# Altium project POWER_SUPPLY_60V_60A.PrjPcb
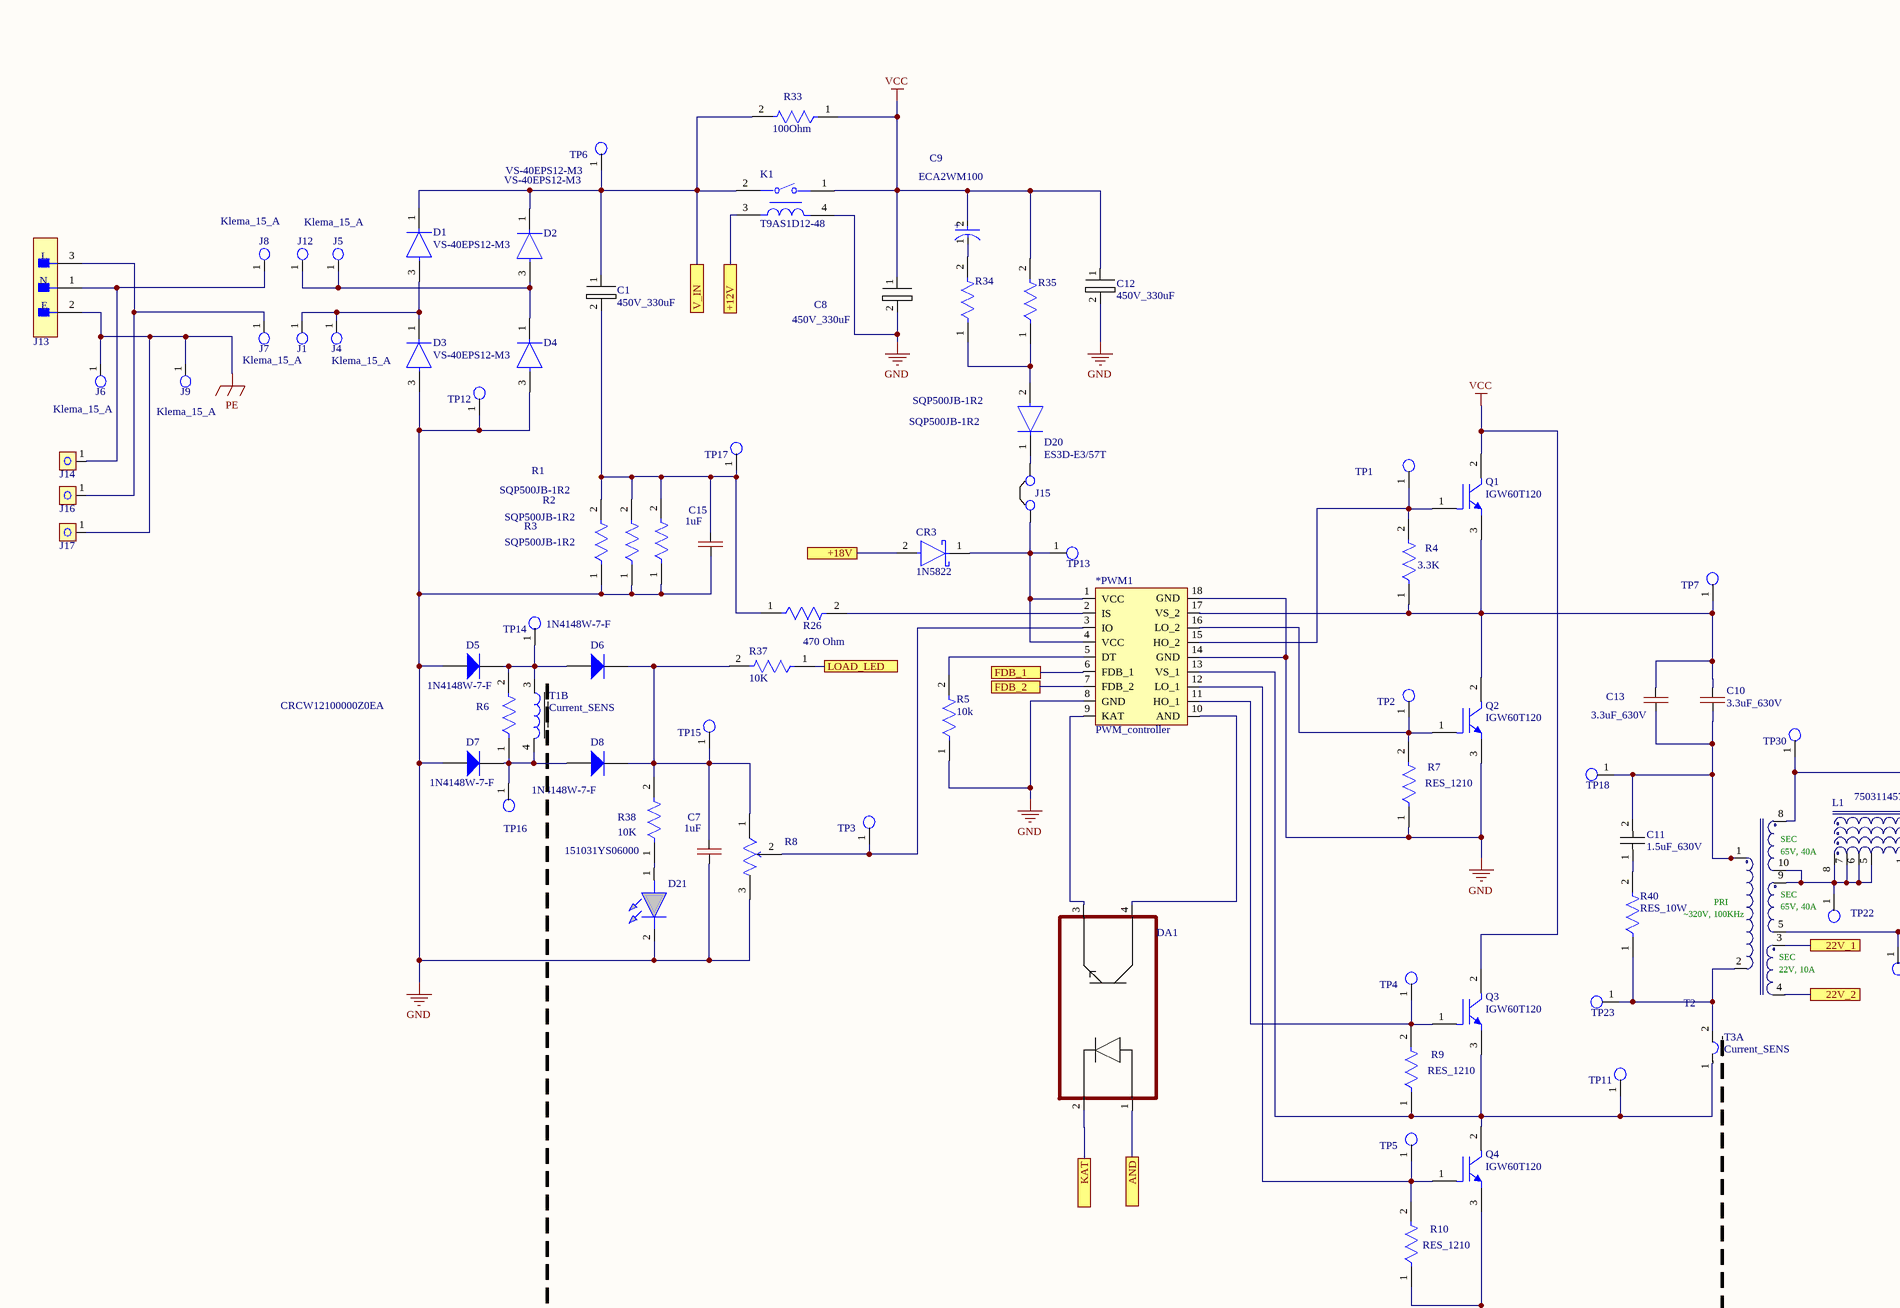
[diagram p0: POWER_SUPPLY_60V_60A.SchDoc, top left]
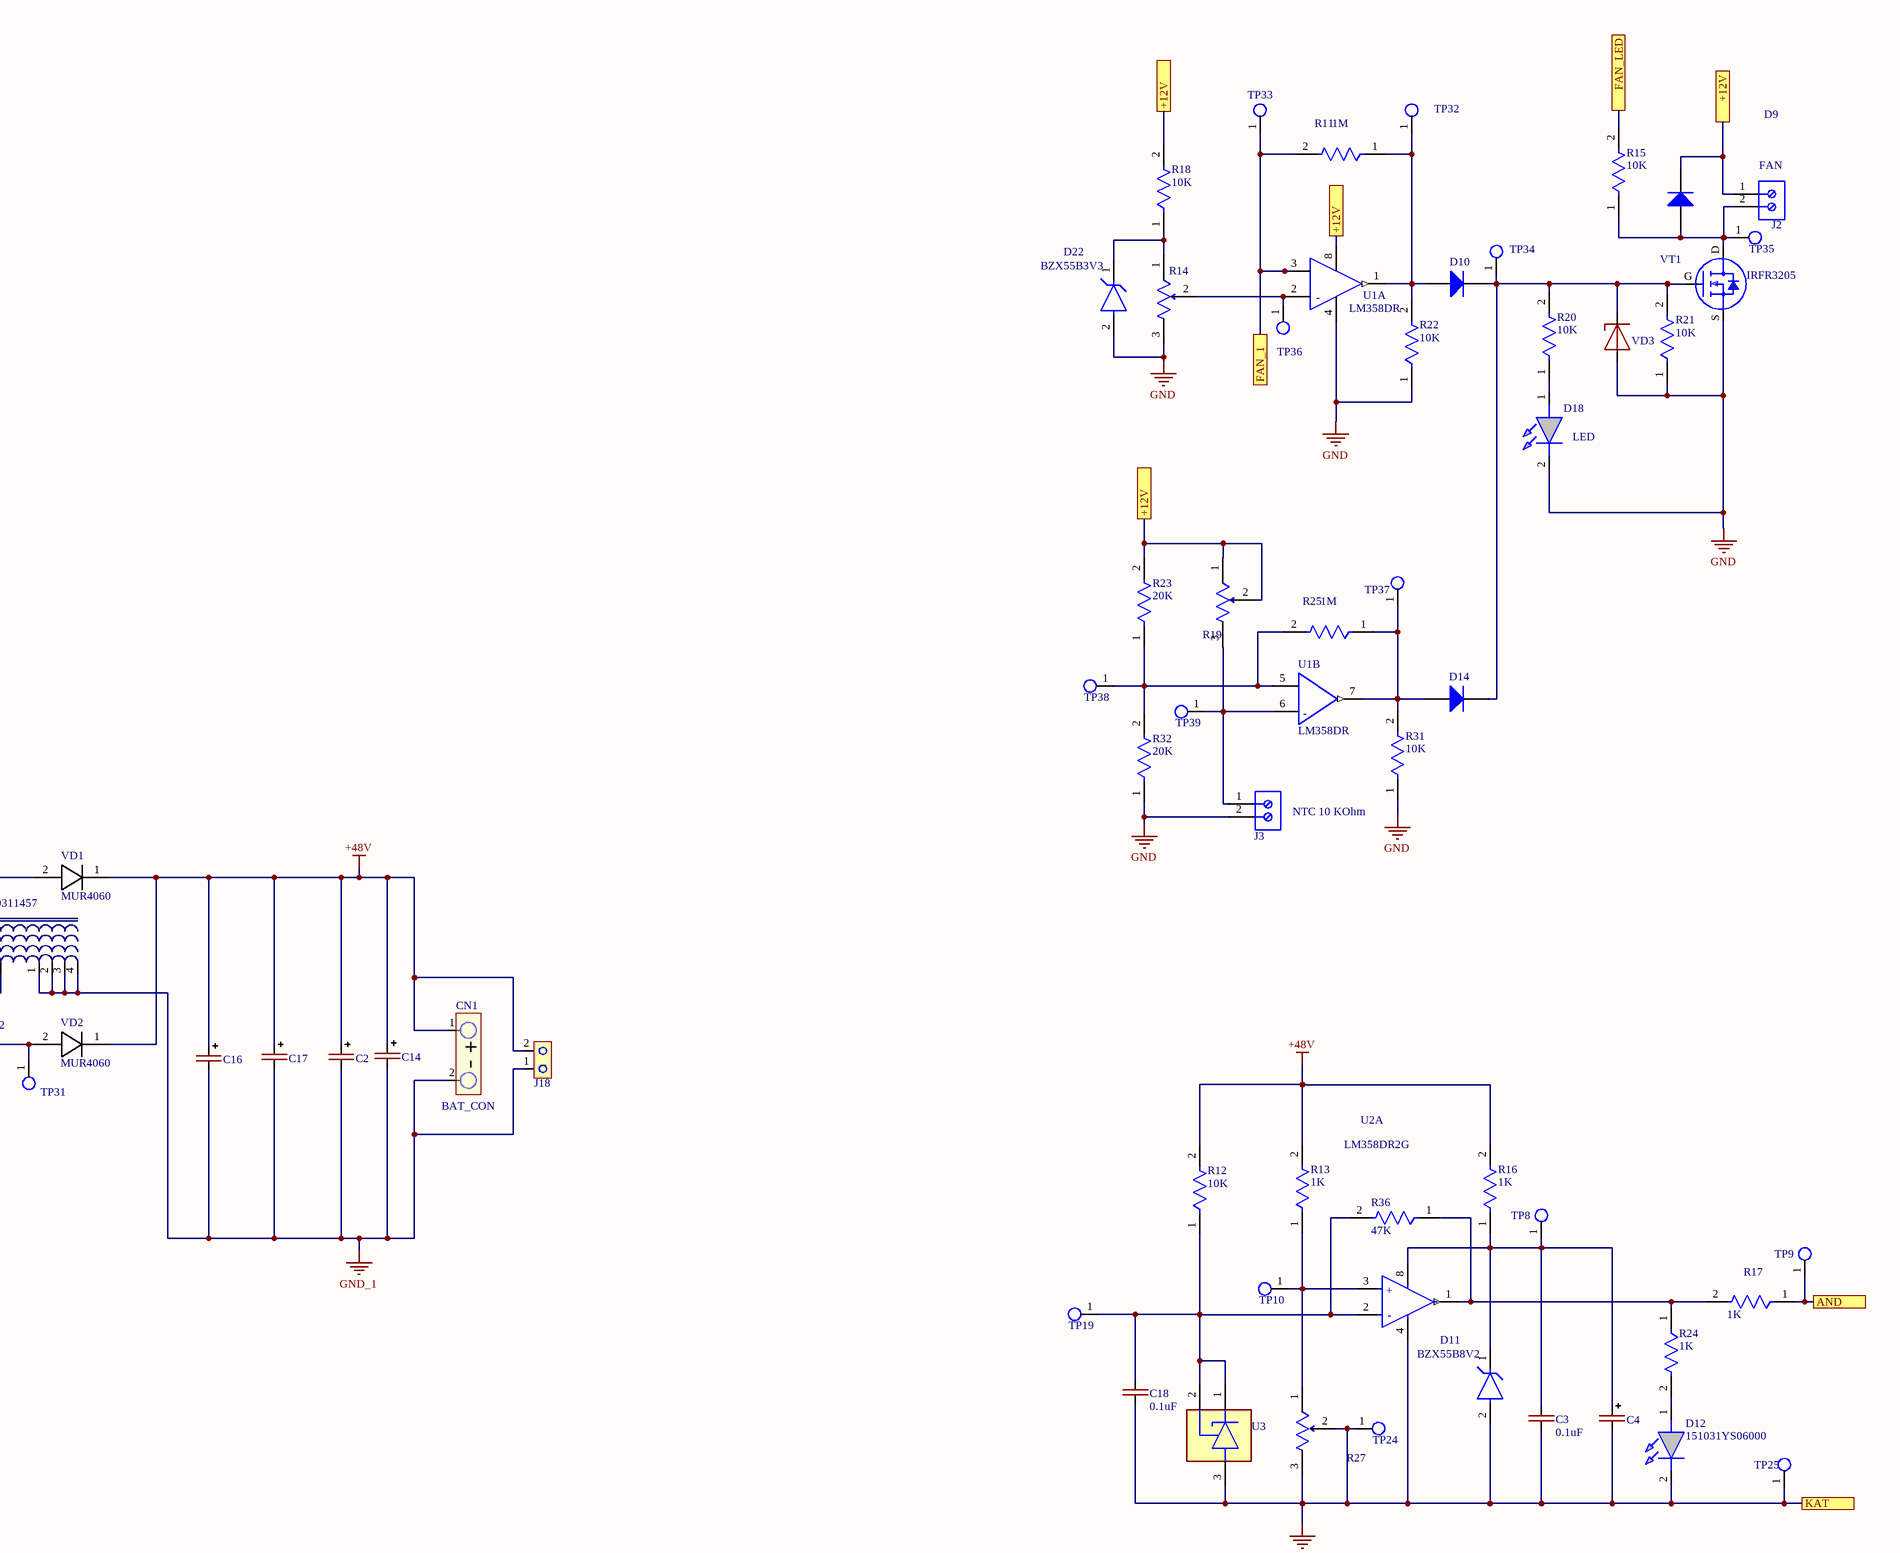
[diagram p1: POWER_SUPPLY_60V_60A.SchDoc, top right]
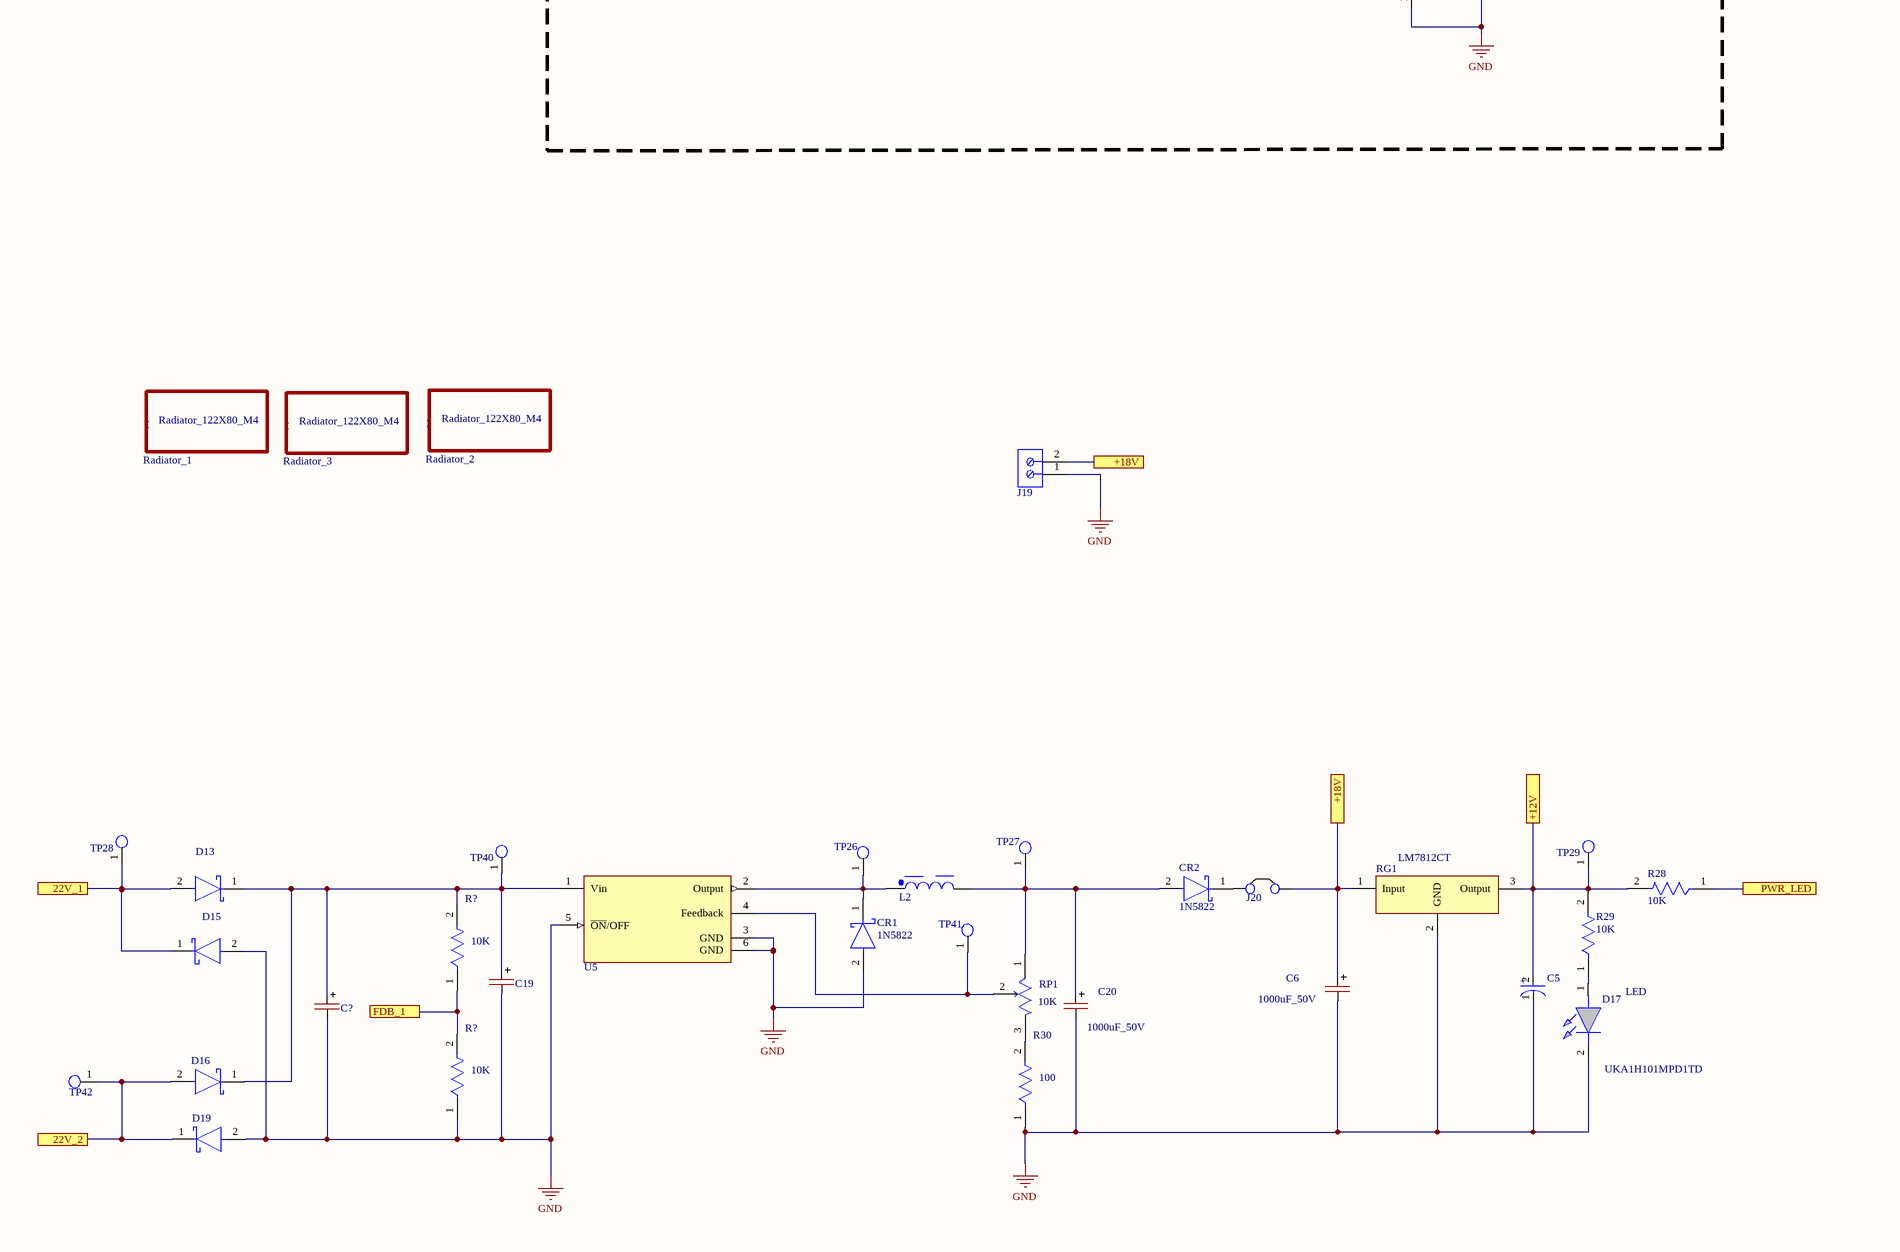
[diagram p2: POWER_SUPPLY_60V_60A.SchDoc, bottom left]
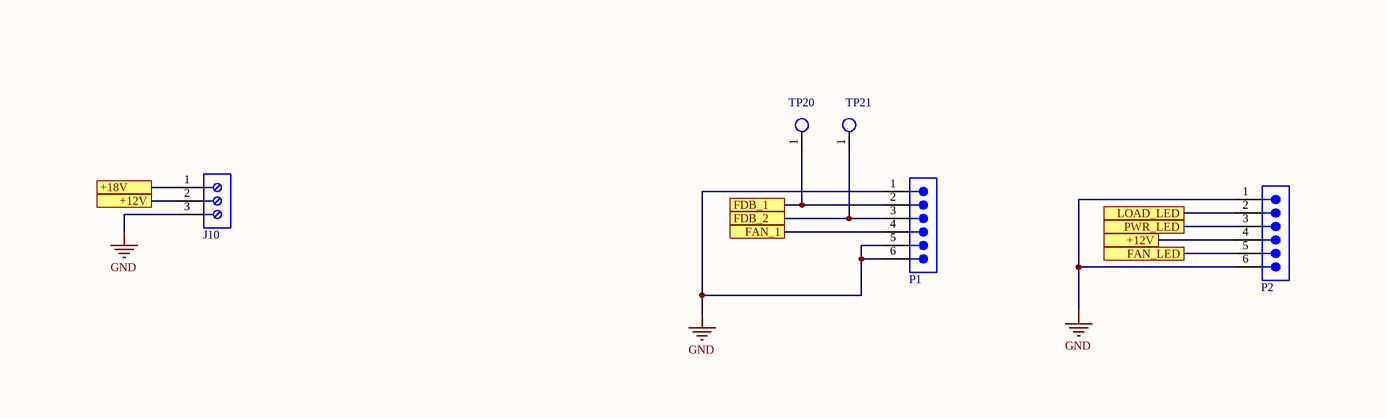
[diagram p3: POWER_SUPPLY_60V_60A.SchDoc, bottom right]
1 sheet, 176 parts. Net scope: flat (ports and power ports of the same name join across sheets).
Board file: POWER_SUPPLY_60V_60A.PcbDoc

## Sheet POWER_SUPPLY_60V_60A.SchDoc
size A1; SheetNumber: 1; SheetTotal: 1

### Parts
(Parts that share a designator on the sheet are numbered #1, #2 ... from top to bottom, then left to right.)
*PWM1  PWM_controller  [PWM_controller]
C1  450V_330uF  [CAP_450V_330uF]
C2  CAP-POLAR  [CAPPOL-18x40]  (value not drawn)
C3  0.1uF  [CAP-0805]
C4  CAP-POLAR  [CAP-TAN-D]  (value not drawn)
C5  UKA1H101MPD1TD  [FP-UKA1H101MPD1TD-MFG]
C6  1000uF_50V  [CAP_POL_13x26_1000uF_50V]
C7  1uF  [CAP-0805]
C8  450V_330uF  [CAP_450V_470uF]
C9  ECA2WM100  [FP-RAD-TH-D_12_5_0_5-L_20-MFG]
C10  3.3uF_630V  [CAP_4.7uF_630V]
C11  1.5uF_630V  [CAP_1.5uf_400V]
C12  450V_330uF  [CAP_450V_470uF]
C13  3.3uF_630V  [CAP_4.7uF_630V]
C14  CAP-POLAR  [CAPPOL-18x40]  (value not drawn)
C15  1uF  [CAP-0805]
C16  CAP-POLAR  [CAPPOL-30x35]  (value not drawn)
C17  CAP-POLAR  [CAPPOL-18x40]  (value not drawn)
C18  0.1uF  [CAP-0805]
C19  CAP-POLAR  [CAPPOL-18x40]  (value not drawn)
C20  1000uF_50V  [CAP_POL_13x26_1000uF_50V]
C?  CAP-POLAR  [CAPPOL-18x40]  (value not drawn)
CN1  BAT_CON  [Batarey_connector]
CR1  1N5822  [FP-DO-201AD-MFG]
CR2  1N5822  [FP-DO-201AD-MFG]
CR3  1N5822  [FP-DO-201AD-MFG]
D1  VS-40EPS12-M3  [FP-96144-MFG]
D2  VS-40EPS12-M3  [FP-96144-MFG]
D3  VS-40EPS12-M3  [FP-96144-MFG]
D4  VS-40EPS12-M3  [FP-96144-MFG]
D5  1N4148W-7-F  [DIOD-SOD123-2_V]
D6  1N4148W-7-F  [DIOD-SOD123-2_V]
D7  1N4148W-7-F  [DIOD-SOD123-2_V]
D8  1N4148W-7-F  [DIOD-SOD123-2_V]
D9  (no value)  [DIOD-SOD123-2_V]
D10  (no value)  [DIOD-SOD123-2_V]
D11  BZX55B8V2  [BZX55B8V2]
D12  151031YS06000  [LED_BLUE]
D13  (no value)  [SR5100(DO-201AD]
D14  (no value)  [DIOD-SOD123-2_V]
D15  (no value)  [SR5100(DO-201AD]
D16  (no value)  [SR5100(DO-201AD]
D17  LED  [LED_GREEN]
D18  LED  [LED_BLUE]
D19  (no value)  [SR5100(DO-201AD]
D20  ES3D-E3/57T  [DO214-AB]
D21  151031YS06000  [LED_GREEN]
D22  BZX55B3V3  [BZX55B8V2]
DA1  PC817  [4-SMD]  (value not drawn)
J1  (no value)  [Klema_PCB_15A]
J2  691137710002  [691137710002]  (value not drawn)
J3  691137710002  [691137710002]  (value not drawn)
J4  Klema_15_A  [Klema_PCB_15A]
J5  Klema_15_A  [Klema_PCB_15A]
J6  Klema_15_A  [Klema_PCB_15A]
J7  Klema_15_A  [Klema_PCB_15A]
J8  Klema_15_A  [Klema_PCB_15A]
J9  Klema_15_A  [Klema_PCB_15A]
J10  691101710003  [691101710003]  (value not drawn)
J12  (no value)  [Klema_PCB_15A]
J13  L-PE-N  [L-PE-N_Connector_C-14]  (value not drawn)
J14  MG_136_HT  [Conn_MEIGAN_MG136HT]  (value not drawn)
J15  (no value)  [Jumper_2.54]
J16  MG_136_HT  [Conn_MEIGAN_MG136HT]  (value not drawn)
J17  MG_136_HT  [Conn_MEIGAN_MG136HT]  (value not drawn)
J18  TL-800  [Conn_Tianli_T-800]  (value not drawn)
J19  691101710002  [691101710002]  (value not drawn)
J20  (no value)  [Jumper_2.54]
K1  T9AS1D12-48  [NT90RNCS12CB]
L1  750311457  [Drossel]
L2  22µH, 2.04A  [WE-PD2_1054]  (value not drawn)
P1  61900611121  [61900611121]  (value not drawn)
P2  61900611121  [61900611121]  (value not drawn)
Q1  IGW60T120  [TO-264-3]
Q2  IGW60T120  [TO-264-3]
Q3  IGW60T120  [TO-264-3]
Q4  IGW60T120  [TO-264-3]
R1  SQP500JB-1R2  [FP-SQP500-MFG]
R2  SQP500JB-1R2  [FP-SQP500-MFG]
R3  SQP500JB-1R2  [FP-SQP500-MFG]
R4  3.3K  [RES_SMD_1210_IPC_A]
R5  10k  [RES-0805]
R6  CRCW12100000Z0EA  [FP-CRCW1210-e3-IPC_A]
R7  RES_1210  [RES_SMD_1210_IPC_A]
R8  3296W-1-202LF  [Bourns_3296W_MFG]  (value not drawn)
R9  RES_1210  [RES_SMD_1210_IPC_A]
R10  RES_1210  [RES_SMD_1210_IPC_A]
R11  1M  [RES-0805]
R12  10K  [RES-0805]
R13  1K  [RES-0805]
R14  10K  [RES_Adj_3296W_Bourns]  (value not drawn)
R15  10K  [RES-0805]
R16  1K  [RES-0805]
R17  1K  [RES-0805]
R18  10K  [RES-0805]
R19  10K  [RES_Adj_3296W_Bourns]  (value not drawn)
R20  10K  [RES-0805]
R21  10K  [RES-0805]
R22  10K  [RES-0805]
R23  20K  [RES-0805]
R24  1K  [RES-0805]
R25  1M  [RES-0805]
R26  470 Ohm  [RES-0805]
R27  10K  [RES_Adj_3296W_Bourns]  (value not drawn)
R28  10K  [FP-CRCW0805-e3-MFG]
R29  10K  [FP-CRCW0805-e3-MFG]
R30  100  [RES-0805]
R31  10K  [RES-0805]
R32  20K  [RES-0805]
R33  100Ohm  [10W 3 Ohm]
R34  SQP500JB-1R2  [FP-SQP500-MFG]
R35  SQP500JB-1R2  [FP-SQP500-MFG]
R36  47K  [RES-0805]
R37  10K  [FP-CRCW0805-e3-MFG]
R38  10K  [RES-0805]
R40  RES_10W  [10W 3 Ohm]
R?#1  10K  [RES-0805]
R?#2  10K  [RES-0805]
Radiator_1  Radiator_122X80_M4  [Radiator_122X80_M4]  (value not drawn)
Radiator_2  Radiator_122X80_M4  [Radiator_122X80_M4]  (value not drawn)
Radiator_3  Radiator_122X80_M4  [Radiator_122X80_M4]  (value not drawn)
RG1  LM7812CT  [TO-220_Bended_Rad]
RP1  10K  [RES_Adj_3296W_Bourns]
T1  Current_SENS  [Current_Sens_Case]  (part B of 2)
T2  ETD-59_2  [Transformer_ETD59_2]  (value not drawn)
T3  Current_SENS  [Current_Sens_Case]  (part A of 2)
TP1  Test_Point_PCB  [Test_Point]  (value not drawn)
TP2  Test_Point_PCB  [Test_Point]  (value not drawn)
TP3  Test_Point_PCB  [Test_Point]  (value not drawn)
TP4  Test_Point_PCB  [Test_Point]  (value not drawn)
TP5  Test_Point_PCB  [Test_Point]  (value not drawn)
TP6  Test_Point_PCB  [Test_Point]  (value not drawn)
TP7  Test_Point_PCB  [Test_Point]  (value not drawn)
TP8  Test_Point_PCB  [Test_Point]  (value not drawn)
TP9  Test_Point_PCB  [Test_Point]  (value not drawn)
TP10  Test_Point_PCB  [Test_Point]  (value not drawn)
TP11  Test_Point_PCB  [Test_Point]  (value not drawn)
TP12  Test_Point_PCB  [Test_Point]  (value not drawn)
TP13  Test_Point_PCB  [Test_Point]  (value not drawn)
TP14  Test_Point_PCB  [Test_Point]  (value not drawn)
TP15  Test_Point_PCB  [Test_Point]  (value not drawn)
TP16  Test_Point_PCB  [Test_Point]  (value not drawn)
TP17  Test_Point_PCB  [Test_Point]  (value not drawn)
TP18  Test_Point_PCB  [Test_Point]  (value not drawn)
TP19  Test_Point_PCB  [Test_Point]  (value not drawn)
TP20  Test_Point_PCB  [Test_Point]  (value not drawn)
TP21  Test_Point_PCB  [Test_Point]  (value not drawn)
TP22  Test_Point_PCB  [Test_Point]  (value not drawn)
TP23  Test_Point_PCB  [Test_Point]  (value not drawn)
TP24  Test_Point_PCB  [Test_Point]  (value not drawn)
TP25  Test_Point_PCB  [Test_Point]  (value not drawn)
TP26  Test_Point_PCB  [Test_Point]  (value not drawn)
TP27  Test_Point_PCB  [Test_Point]  (value not drawn)
TP28  Test_Point_PCB  [Test_Point]  (value not drawn)
TP29  Test_Point_PCB  [Test_Point]  (value not drawn)
TP30  Test_Point_PCB  [Test_Point]  (value not drawn)
TP31  Test_Point_PCB  [Test_Point]  (value not drawn)
TP32  Test_Point_PCB  [Test_Point]  (value not drawn)
TP33  Test_Point_PCB  [Test_Point]  (value not drawn)
TP34  Test_Point_PCB  [Test_Point]  (value not drawn)
TP35  Test_Point_PCB  [Test_Point]  (value not drawn)
TP36  Test_Point_PCB  [Test_Point]  (value not drawn)
TP37  Test_Point_PCB  [Test_Point]  (value not drawn)
TP38  Test_Point_PCB  [Test_Point]  (value not drawn)
TP39  Test_Point_PCB  [Test_Point]  (value not drawn)
TP40  Test_Point_PCB  [Test_Point]  (value not drawn)
TP41  Test_Point_PCB  [Test_Point]  (value not drawn)
TP42  Test_Point_PCB  [Test_Point]  (value not drawn)
U1  LM358DR  [FP-D0008A-MFG]  (parts A,B of 2)
U2  LM358DR2G  [FP-751-07-IPC_C]  (part A of 2)
U3  (no value)  [TL431_SOT-23-3(A)]
U5  (no value)  [ON_Semiconductor_936A-02_MFG]
VD1  MUR4060  [TO-247-2]
VD2  MUR4060  [TO-247-2]
VD3  ZENER  [DO-017AA]  (value not drawn)
VT1  IRFR3205  [TO-220(bend2)]

### Ports
22V_1, 22V_2, +12V, +18V, AND, FAN_1, FAN_LED, FDB_1, FDB_2, KAT, LOAD_LED, PWR_LED, V_IN

### Nets
+48V: C2.1(+) C14.1(+) C16.1(+) C17.1(+) CN1.1(+) J18.2 R12.2 R13.2 R16.2 VD1.1 VD2.1
GND: *PWM1.8(GND) *PWM1.14(GND) *PWM1.18(GND) C5.1(C) C6.2(-) C7.2 C8.2 C12.2 C15.2 C19.2(-) C20.2(-) C?.2(-) CR1.2(A) D3.3(A) D4.3(A) D5.1(K) D7.1(K) D15.2(A) D17.2(K) D18.2(K) D19.2(A) D21.2(K) D22.2(A) J3.2 J10.3 J19.1 K1.4 P1.1 P1.5 P1.6 P2.1 P2.6 Q2.3(E) Q4.3(E) R1.1 R2.1 R3.1 R5.1 R7.1 R8.3(CW) R10.1 R14.3(CW) R21.1 R22.1 R30.1 R31.1 R32.1 R?#2.1 RG1.2(GND) TP12.1(G9) U1.4(V-) U5.3(GND) U5.5(~{ON}/OFF) U5.6(GND) VD3.2(A) VT1.S
GND_1: C2.2(-) C3.1 C4.2(-) C14.2(-) C16.2(-) C17.2(-) C18.1 CN1.2(-) D11.2(A) D12.2(K) DA1.2(CATHODE) J18.1 L1.1 L1.2 L1.3 L1.4 R27.2(WIPER) R27.3(CW) TP24.1(G9) TP25.1(G9) U2.4(VEE/GND) U3.3(A) ; port KAT
PE: J6.1 J9.1 J13.2(E) J17.1
VCC: C8.1 C9.2(A) C12.1 K1.1 Q1.2(C) Q3.2(C) R33.1 R35.2
Net*PWM1_1: *PWM1.1(VCC) *PWM1.4(VCC) CR3.1(C) J15.1 TP13.1(G9)
Net*PWM1_2: *PWM1.2(IS) R26.2
Net*PWM1_3: *PWM1.3(IO) R8.2(WIPER) TP3.1(G9)
Net*PWM1_5: *PWM1.5(DT) R5.2
Net*PWM1_6: *PWM1.6(FDB_1) P1.2 R?#1.1 R?#2.2 TP20.1(G9) ; port FDB_1
Net*PWM1_7: *PWM1.7(FDB_2) P1.3 TP21.1(G9) ; port FDB_2
Net*PWM1_9: *PWM1.9(KAT) DA1.3(EMITTER)
Net*PWM1_10: *PWM1.10(AND) DA1.4(COLLECTOR)
Net*PWM1_11: *PWM1.11(HO_1) Q3.1(G) R9.2 TP4.1(G9)
Net*PWM1_12: *PWM1.12(LO_1) Q4.1(G) R10.2 TP5.1(G9)
Net*PWM1_13: *PWM1.13(VS_1) Q3.3(E) Q4.2(C) R9.1 T3.1 TP11.1(G9)
Net*PWM1_15: *PWM1.15(HO_2) Q1.1(G) R4.2 TP1.1(G9)
Net*PWM1_16: *PWM1.16(LO_2) Q2.1(G) R7.2 TP2.1(G9)
Net*PWM1_17: *PWM1.17(VS_2) C10.2 C13.2 Q1.3(E) Q2.2(C) R4.1 TP7.1(G9)
NetC1_1: C1.1 D1.1(C) D2.1(C) K1.2 R33.2 TP6.1(G9) ; port V_IN
NetC1_2: C1.2 C15.1 R1.2 R2.2 R3.2 R26.1 TP17.1(G9)
NetC3_2: C3.2 C4.1(+) D11.1(C) R16.1 TP8.1(G9) U2.8(VCC)
NetC5_2: C5.2(A) D9.1(K) J2.1 J10.2 K1.3 P2.4 R18.2 R19.1(CCW) R19.2(WIPER) R23.2 R28.2 R29.2 RG1.3(Output) TP29.1(G9) U1.8(V+) ; port +12V
NetC6_1: C6.1(+) CR3.2(A) J10.1 J19.2 J20.2 RG1.1(Input) ; port +18V
NetC7_1: C7.1 D6.2(A) D8.2(A) R8.1(CCW) R37.2 R38.2 TP15.1(G9)
NetC9_1: C9.1(C) R34.2
NetC10_1: C10.1 C11.2 C13.1 T2.1 TP18.1(G9)
NetC11_1: C11.1 R40.2
NetC18_2: C18.2 R12.1 R36.2 TP19.1(G9) U2.2(INPUT_A-) U3.1(C) U3.2(REF)
NetC19_1: C19.1(+) C?.1(+) D13.1(C) D16.1(C) R?#1.2 TP40.1(G9) U5.1(Vin)
NetC20_1: C20.1(+) CR2.2(A) L2.2 RP1.1(CCW) TP27.1(G9)
NetCR1_1: CR1.1(C) L2.1 TP26.1(G9) U5.2(Output)
NetCR2_1: CR2.1(C) J20.1
NetD1_3: D1.3(A) D3.1(C) J1.1 J4.1
NetD2_3: D2.3(A) D4.1(C) J5.1 J12.1
NetD5_2: D5.2(A) D6.1(K) R6.2 T1.3 TP14.1(G9)
NetD7_2: D7.2(A) D8.1(K) R6.1 T1.4 TP16.1(G9)
NetD9_2: D9.2(A) J2.2 R15.1 TP35.1(G9) VT1.D
NetD10_1: D10.1(K) D14.1(K) R20.2 R21.2 TP34.1(G9) VD3.1(C) VT1.G
NetD10_2: D10.2(A) R11.1 R22.2 TP32.1(G9) U1.1(1OUT)
NetD12_1: D12.1(A) R24.2
NetD13_2: D13.2(A) D15.1(C) T2.3 TP28.1(G9) ; port 22V_1
NetD14_2: D14.2(A) R25.1 R31.2 TP37.1(G9) U1.7(2OUT)
NetD16_2: D16.2(A) D19.1(C) T2.4 TP42.1(G9) ; port 22V_2
NetD17_1: D17.1(A) R29.1
NetD18_1: D18.1(A) R20.1
NetD20_1: D20.1(C) J15.2
NetD20_2: D20.2(A) R34.1 R35.1
NetD21_1: D21.1(A) R38.1
NetD22_1: D22.1(C) R14.1(CCW) R18.1
NetDA1_1: DA1.1(ANODE) R17.1 TP9.1(G9) ; port AND
NetJ3_1: J3.1 R19.3(CW) TP39.1(G9) U1.6(IN2-)
NetJ7_1: J7.1 J13.3(L) J16.1
NetJ8_1: J8.1 J13.1(N) J14.1
NetL1_5: L1.5 L1.6 L1.7 L1.8 T2.9 T2.10 TP22.1(G9)
NetP1_4: P1.4 R11.2 TP33.1(G9) U1.3(IN1+) ; port FAN_1
NetP2_2: P2.2 R37.1 ; port LOAD_LED
NetP2_3: P2.3 R28.1 ; port PWR_LED
NetP2_5: P2.5 R15.2 ; port FAN_LED
NetR13_1: R13.1 R27.1(CCW) TP10.1(G9) U2.3(INPUT_A+)
NetR14_2: R14.2(WIPER) TP36.1(G9) U1.2(IN1-)
NetR17_2: R17.2 R24.1 R36.1 U2.1(OUTPUT_A)
NetR23_1: R23.1 R25.2 R32.2 TP38.1(G9) U1.5(IN2+)
NetR30_2: R30.2 RP1.3(CW)
NetR40_1: R40.1 T2.2 T3.2 TP23.1(G9)
NetRP1_2: RP1.2(WIPER) TP41.1(G9) U5.4(Feedback)
NetT2_5: T2.5 TP31.1(G9) VD2.2
NetT2_8: T2.8 TP30.1(G9) VD1.2

### Notes on the sheet
- (near J2) FAN
- NTC 10 KOhm
- (in symbol CMP-1310-00291-2, part A) +; -
- (in symbol CMP-1685-00009-2, part A) -
- (in symbol CMP-1685-00009-2, part B) -
- (in symbol CMP-05427-001155-1) +
- (in symbol CMP-12462-000027-1) +
- (in symbol Transformer_ETD_59_2) SEC; 65V, 40A; PRI; ~320V, 100KHz; 22V, 10A

### Library data of the parts
C1 C8 C12 = CAP_POL_LOW_IMP
C3 C7 C10 C13 C15 C18 = CAP-NON-POLAR
C5 = CMP-12462-000027-1: CAP ALUM 100UF 20% 50V RADIAL; Life (Hours): 2000Hour; Ripple Current: 190mA; Leakage Current: 4uA; Termination: Radial; Mount: Through Hole; Length: 11.5mm; Series: KA; Case/Package: Radial; Package Quantity: 1; REACH SVHC: No SVHC; Height - Seated (Max): 0.512inch; Min Operating Temperature: -55°C; Packaging: Tape and Reel; Tolerance: 20%; Lead Pitch: 3.5mm; Voltage Rating (DC): 50V; Voltage Rating: 50V; Diameter: 8mm; Height: 11.5mm; Max Operating Temperature: 105°C; Capacitance: 100uF
C6 C20 = CAP_polar_Hitano
C9 = CMP-05427-001155-1: Aluminum Electrolytic Capacitors (Radial Lead Type) 10uF ±20% 450V; Ripple Current (AC): 130mA; Lead/Base Style: Straight; Leakage Current: 10uA; Lead Diameter: 0.6mm; Polarity: Polar; Life (Hours): 2000Hour; Dissipation Factor: 0.2%; Dielectric Material: Aluminium; Max Operating Temperature: 85°C; Capacitance: 10uF; Tolerance: 20%; Min Operating Temperature: -25°C; Height - Seated (Max): 0.866inch; Case/Package: Radial; Voltage Rating: 450V; Length: 20mm; Voltage: 450V; Diameter: 12.5mm; Number of Pins: 2; Lead Free: Lead Free; Packaging: Bulk; Mount: Through Hole; Series: M; RoHS Compliant: Yes; Ripple Current: 130mA; REACH SVHC: No SVHC; Voltage Rating (DC): 450V; Radiation Hardening: No; Termination: Radial; Lead Pitch: 5mm; Package Quantity: 200; Height: 20mm; Construction: RADIAL
C11 = 3.3uF_630V
CN1 = BAT_CON: Batarey_connection
CR1-CR3 = 1N5822: DIODE SCHOTTKY 40V 3A DO201AD; Manufacturer: STMicroelectronics; Max Junction Temp: +150°C; Peak Reverse Current: 2mA; Max Surge Forward Current: 80A; Temperature Range High: +150°C; Automotive: No; RoHS: TRUE; ComponentLink2Description: Datasheet; Manufacturer Part Number: 1N5822; Lead Free: Yes; Octopart: https://octopart.com/1n5822-stmicroelectronics-323225; Device Class L2: Diodes; Max Repetitive Reverse Voltage: 40V; Temperature: to +150°C; Height: 5.3mm; Category: Diode; Digikey Description: DIODE SCHOTTKY 40V 3A DO201AD; ComponentLink2URL: https://www.st.com/resource/en/datasheet/1n5822.pdf; Device Class L3: Schottky Diodes; Device Class L1: Discrete Semiconductors; Forward Current: 3A; Mouser Description: Schottky Diodes & Rectifiers Vr/40V Io/3A BULK; Package: DO-201AD
D1-D4 = CMP-02540-000097-1: DIODE GP 1.2KV 40A TO247AC; Series: -; Case/Package: TO-247-2; Mount: Through Hole; Max Reverse Voltage (DC): 1.2kV; RoHS Compliant: Yes; Packaging: Rail/Tube; Average Rectified Current: 40A
D5-D10 D14 = 1N4148: Fast Switching Diode, 100 V, 0.15 A, -65 to 150 degC, 2-Pin?SOD123, RoHS, Tape and Reel; Recovery Time: 4ns; Brand: DiodesIncorporated; Unit Weight: 0.000353oz; Max Surge Current: 2A; Peak Reverse Voltage: 100V; Ir - Reverse Current: 1uA; Vf - Forward Voltage: 1.25V; Configuration: Single; If - Forward Current: 0.15A; Product Category: Diodes-GeneralPurpose,Power,Switching; Operating Temperature Range: -65Cto+150C; Packaging: Reel; Manufacturer URL: http://www.diodes.com/; Maximum Operating Temperature: +150C; Height: 1.25mm; Minimum Operating Temperature: -65C; Product: SwitchingDiodes; Package URL: http://www.diodes.com/datasheets/ds18004.pdf; Type: SwitchingDiode; Package Reference: SOD123-2; Width: 1.7mm; Datasheet URL: http://www.farnell.com/datasheets/1915529.pdf; Datasheet Version: Rev. 24-2, 10/2013; Series: 1N4148; Factory Pack Quantity: 3000; Length: 2.85mm; RoHS: True; Manufacturer: DiodesIncorporated; Mounting Style: SMD/SMT; Package / Case: SOD-123
D12 D17 D18 D21 = LED: WURTH ELEKTRONIK - 151031YS06000 - LED, Yellow, Through Hole, T-1 (3mm), 30 mA, 2 V, 590 nm; Geometry.Height: 5.5mm; Manufacturer_Name: Wurth Elektronik; Manufacturer_Part_Number: 151031YS06000; Mouser Part Number: 710-151031YS06000; Mouser Price/Stock: https://www.mouser.co.uk/ProductDetail/Wurth-Elektronik/151031YS06000?qs=LlUlMxKIyB3xSYYW%252BcuBiQ%3D%3D; Arrow Part Number: *; Arrow Price/Stock: *; Mouser Testing Part Number: *; Mouser Testing Price/Stock: *; Datasheet Link: https://katalog.we-online.de/led/datasheet/151031YS06000.pdf
D13 D15 D16 D19 = SR5100
D20 = ES3D-DO214AB
D22 = BZX55B8V2
J1 J12 = Klema_15_A
J2 J3 = 691137710002: WR-TBL Series 1377 Horizontal Entry, THT, pitch 5mm, 2p; Manufacturer: Wurth Elektronik; Modularity: No; Rated Current: 16A; Working Voltage: 300V; ComponentLink1Description: Website Link; ComponentLink1URL: https://www.we-online.com/redexpert/article/691137710002?ad; ComponentLink2Description: Datasheet Link; ComponentLink2URL: https://www.we-online.com/redexpert/spec/691137710002?ad; Manufacturer Part Number: 691137710002; Category: Terminal Blocks; Match Code: WR-TBL; Mount: Through Hole; Operating Temperature Max: 120°C; Operating Temperature Min: -30°C; Packaging: Box; Application: Pressure Clamp; Number of Pins: 2; Number of Rows: 1; Orientation: Horizontal; Pitch: 5mm
J10 = 691101710003: WR-TBL Series 101 Horizontal Entry Modular, THT, pitch 5mm, 3p; Manufacturer: Wurth Elektronik; Modularity: Yes; Rated Current: 16A; Working Voltage: 250V; ComponentLink1Description: Website Link; ComponentLink1URL: https://www.we-online.com/redexpert/article/691101710003?ad; ComponentLink2Description: Datasheet Link; ComponentLink2URL: https://www.we-online.com/redexpert/spec/691101710003?ad; Manufacturer Part Number: 691101710003; Category: Terminal Blocks; Match Code: WR-TBL; Mount: Through Hole; Operating Temperature Max: 105°C; Operating Temperature Min: -40°C; Packaging: Box; Application: Pressure Clamp; Number of Pins: 3; Number of Rows: 1; Orientation: Horizontal; Pitch: 5mm
J13 = C-14
J14 J16 J17 = Connector_MEIGAN_MG136HT
J15 J20 = Jumper 1x2.54
J18 = Connector_Tianli_T-800
J19 = 691101710002: WR-TBL Series 101 Horizontal Entry Modular, THT, pitch 5mm, 2p; Manufacturer: Wurth Elektronik; Modularity: Yes; Rated Current: 16A; Working Voltage: 250V; ComponentLink1Description: Website Link; ComponentLink1URL: https://www.we-online.com/redexpert/article/691101710002?ad; ComponentLink2Description: Datasheet Link; ComponentLink2URL: https://www.we-online.com/redexpert/spec/691101710002?ad; Manufacturer Part Number: 691101710002; Category: Terminal Blocks; Match Code: WR-TBL; Mount: Through Hole; Operating Temperature Max: 105°C; Operating Temperature Min: -40°C; Packaging: Box; Application: Pressure Clamp; Number of Pins: 2; Number of Rows: 1; Orientation: Horizontal; Pitch: 5mm
K1 = CMP-03396-000117-1: RELAY GEN PURPOSE SPST 30A 48V; Coil Type: Non-Latching; Coil Power: 1W; Voltage Rating (AC): 277V; Approvals: UL; Relay Type: General Purpose; Coil Resistance: 2.304kR; Coil Current: 21mA; Life (Hours): 100000Hour; Operate Time: 15ms; Power Consumption: 4W; Depth: 27.43mm; Length: 32.5mm; RoHS Compliant: Yes; Height: 20.4mm; Max Operating Temperature: 85°C; Package Quantity: 50; Number of Pins: 4; Radiation Hardening: No; Termination: PCB; Contact Voltage Rating (AC): 277V; Width: 27.4mm; Current Rating: 30A; ELV: Non-Compliant; Packaging: Tray; Coil Voltage (DC): 48V; Lead Free: Lead Free; Contact Current Rating: 30A; Contact Material: Silver; Application(s): GENERAL PURPOSE; Throw Configuration: SPST; Weight: 0.918oz; Series: T9A; Release Time: 15ms; Min Operating Temperature: -55°C; Max Voltage Rating (AC): 277V; Mount: Through Hole
L1 = DROSEL: Manufacturer: Wuerth Elektronik; Ui: 36V; ComponentLink1Description: Manufacturer URL; ComponentLink2Description: Datasheet; ComponentLink1URL: http://www.we-online.com; PartNumber: 750311457; PackageReference: EP13; ComponentLink2URL: http://katalog.we-online.de/pbs/datasheet/750311457.pdf
L2 = 744776122: WE-PD2 SMT Power Inductor, size 1054, 22µH, 2.04A, 0.1Ω; Manufacturer: Wurth Elektronik; Case/Size Code: 1054; DC Resistance: 0.051Ω; Saturation Current: 2.07A; Self Resonant Frequency: 16MHz; Manufacturer Part Number: 744776122; Category: Unshielded Power Inductors; Match Code: WE-PD2; ComponentLink1Description: Website Link; ComponentLink1URL: https://www.we-online.com/redexpert/article/744776122?ad; ComponentLink2Description: Datasheet Link; ComponentLink2URL: https://www.we-online.com/redexpert/spec/744776122?ad; Mount: Surface Mount; Operating Temperature Max: 125°C; Operating Temperature Min: -40°C; Packaging: Tape and Reel; Length: 10mm; Width: 9mm; Height: 5.4mm; DC Resistance Max: 0.1Ω; Inductance: 22µH; Rated Current: 2.04A
P1 P2 = 61900611121: WR-WTB THT Male Vertical Locking Header, pitch 2.54mm, 6pins; Manufacturer: Wurth Elektronik; Contact Resistance: 20mΩ; Rated Current: 3A; Working Voltage: 250VAC; Withstanding Voltage: 1000VAC; ComponentLink1Description: Website Link; ComponentLink1URL: https://www.we-online.com/redexpert/article/61900611121?ad; ComponentLink2Description: Datasheet Link; ComponentLink2URL: https://www.we-online.com/redexpert/spec/61900611121?ad; Manufacturer Part Number: 61900611121; Category: Wire-to-Board Connectors; Match Code: WR-WTB; Mount: Through Hole; Operating Temperature Max: 105°C; Operating Temperature Min: -40°C; Packaging: Bag; Length: 15.24mm; Width: 5.8mm; Height: 11.5mm; Gender: Male; Number of Pins: 6; Number of Rows: 1; Orientation: Vertical; Pitch: 2.54mm
Q1-Q4 = CMP-1168-00042-1: Low Loss IGBT in TrenchStop and Fieldstop Technology, PG-TO247-3-44, Tube, Green; Manufacturer: Infineon; IC(max) @ 25 degC: 100 A; Switching Frequency: TRENCHSTOP 2-20kHz; Green: TRUE; VCE(sat) (typ): 2.3 V; VCE (max): 1,200 V; DatasheetVersion: Rev. 2.4; ComponentLink2Description: Datasheet; PackageDescription: 3-Pin Plastic (Green) Transistor Single Outline Package, Body 15.915 x 20.95 mm, Pitch 5.44 mm; PartNumber: IGW60T120; PackageVersion: Rev. 05, 07/2010; ComponentLink1Description: Manufacturer URL; ComponentLink3URL: http://www.infineon.com/dgdl/IDW10S120_Rev+2.pdf?folderId=db3a304314dca38901151224afae0c96&fileId=db3a304336724dc40136789691a04aa5; RevisionNote: Lost Devices pt2; Mounting Technology: Through Hole; ComponentLink3Description: Package Specification; ComponentLink1URL: http://www.infineon.com/; ComponentLink2URL: http://www.infineon.com/dgdl/IGW60T120_Rev2_4G.pdf?folderId=db3a304412b407950112b408e8c90004&fileId=db3a304412b407950112b428250e3d74; Packing: Tube; PackageReference: PG-TO247-3-44_A; Halogen-free: FALSE
R1-R3 = RES-CONST: 0.5 Ohm
R4 = RES_1210
R5 R11-R13 R15-R18 R20-R25 R30-R32 R36 R38 R?#1 R?#2 = RES-CONST
R6 = CMP-2005-01987-2: RES SMD 205K OHM 1% 1/2W 1992; Resistance: 0mR; Temperature Coefficient: 0ppm/°C; Max Power Dissipation: 500mW; Voltage Rating: 200V; Packaging: Tape and Reel; Max Operating Temperature: 155°C; REACH SVHC: No SVHC; Min Operating Temperature: -55°C; Package Quantity: 1; Length: 3.2mm; Case Code (Metric): 3225; Case/Package: 1210; Composition: Thick Film; Military Standard: Not; Contact Plating: Tin; Case Code (Imperial): 1210; Radiation Hardening: No; Depth: 2.5mm; Termination: SMD/SMT; Features: Automotive AEC-Q200; Width: 0.098inch; Mount: Surface Mount; Power Rating: 500mW; Weight: 0.000564oz; Number of Terminations: 2; Height: 0.55mm
R8 R14 R19 R27 RP1 = RES_Adj
R26 = RES-CONST: 470
R28 R29 R37 = CMP-2001-04908-2: RES Thick Film, 10KΩ, 1%, 0.125W, 100ppm/°C, 0805; Resistance: 10kR; Voltage Rating (DC): 150V; Power Rating: 125mW; Weight: 0.000194oz; Package Quantity: 5000; Military Standard: Not; Max Operating Temperature: 155°C; Temperature Coefficient: 100ppm/°C; Contact Plating: Tin; Width: 1.25mm; Height: 0.45mm; Radiation Hardening: No; Tolerance: 1%; Min Operating Temperature: -55°C; Voltage Rating: 150V; Length: 2mm; Depth: 1.25mm; Termination: SMD/SMT; Packaging: Tape and Reel; Case/Package: 0805; Case Code (Metric): 2012; Lead Free: Lead Free; Case Code (Imperial): 0805; Composition: Thick Film
R33 = RES_10W
R34 R35 = CMP-03413-000003-1: RES 1.2 OHM 5W 5% AXIAL; Manufacturer: Yageo; Temperature Coefficient: 300ppm/°C; Resistance: 1.2Ω; Value: 1.2Ω; Voltage Rating: 350V; Lead Free: Yes; Package: SQP500; Composition: Wirewound; Series: SQP; Temperature: -55°C to +155°C; Device Class L2: Resistors; Digikey Description: RES 1.2 OHM 5W 5% AXIAL; RoHS: TRUE; Device Class L3: Through-Hole Resistors; ComponentLink2Description: Datasheet; ComponentLink2URL: https://datasheet.ciiva.com/2723/yageolr-sqpnsp-2013-2723111.pdf; Temperature Range High: +155°C; Manufacturer Part Number: SQP500JB-1R2; Octopart: https://octopart.com/sqp500jb-1r2-yageo-1162571; Device Class L1: Passive Components; Tolerance: 5%; Height: 10mm; Category: Res; Ipc Land Pattern Name: RESAD2911W100L2350D1050; Automotive: No; Power Rating: 5W; Temperature Range Low: -55°C
RG1 = LM7812CT: REG IC REG LINEAR 12V 1A TO220AB; Manufacturer: Fairchild; Voltage Dropout (Max): 2V @ 1A (Typ); Voltage - Input (Max): 35V; Voltage - Output: 5V; helpURL: https://upverter.com/upn/revision/b27a7358b7dd93a3/; ComponentLink2Description: Datasheet; Temperature: -40°C to +125°C; Package: TO220; Supplier 2: Mouser; Price: 0.384521982769; Supplier 1: Digi-Key; ComponentLink1URL: https://upverter.com/upn/revision/b27a7358b7dd93a3/; Supplier Part Number 2: 512-LM7805CT; Supplier Part Number 1: LM7805CT-ND; ComponentLink1Description: Upverter; ComponentLink2URL: https://www.fairchildsemi.com/datasheets/LM/LM7805.pdf; RoHS: TRUE; Mouser Part Number: 512-LM7805CT; Ipc Land Pattern Name: TO-220; Temperature Range High: +125°C; Digikey Description: REG IC REG LINEAR 5V 1A TO220AB; Digikey Part Number: LM7805CT-ND; Lead Free: yes; Temperature Range Low: -40°C; Current-Output: 1A; Part Number: LM7812CT
T2 = Transformer_ETD_59_2
TP1-TP42 = TP_PCB?: Test_Point
U1 = CMP-1685-00009-2: IC OPAMP GP 2 CIRCUIT 8SOIC; Output Current: 30mA; Min Dual Supply Voltage: 1.5V; Input Offset Voltage (Vos): 7mV; Power Supply Rejection Ratio (PSRR): 65dB; Unity Gain Bandwidth Product: 700kHz; Number of Channels: 2; Min Supply Voltage: 3V; Max Dual Supply Voltage: 16V; Dual Supply Voltage: 9V; Max Supply Voltage: 32V; Nominal Supply Current: 1.2mA; Slew Rate: 0.3V/µs; Input Bias Current: 250nA; Voltage Gain: 100dB; Operating Supply Current: 1mA; REACH SVHC: No SVHC; Package Quantity: 2500; Width: 3.91mm; Max Operating Temperature: 70°C; Min Operating Temperature: 0°C; Mount: Surface Mount; Length: 4.9mm; Radiation Hardening: No; Case/Package: SOIC; Lead Free: Lead Free; Number of Elements: 2; Packaging: Tape and Reel; Output Current per Channel: 30mA; Number of Circuits: 2; Bandwidth: 700kHz; Operating Supply Voltage: 16V; Gain Bandwidth Product: 700kHz; Number of Pins: 8; Number of Amplifiers: 2; Height: 1.58mm; Common Mode Rejection Ratio: 65dB; Contact Plating: Gold
U2 = CMP-1310-00291-2: IC OPAMP GP 2 CIRCUIT 8SOIC; Gain Bandwidth Product: 1MHz; Number of Circuits: 2; Min Supply Voltage: 3V; Slew Rate: 0.6V/µs; Max Dual Supply Voltage: 16V; Common Mode Rejection Ratio: 65dB; Input Bias Current: 250nA; Min Dual Supply Voltage: 1.5V; Dual Supply Voltage: 9V; Operating Supply Current: 1.5mA; Output Current: 40mA; Input Offset Voltage (Vos): 7mV; Nominal Supply Current: 1.2mA; Voltage Gain: 100dB; Max Supply Voltage: 32V; Width: 4mm; Number of Pins: 8; Min Operating Temperature: 0°C; REACH SVHC: No SVHC; Contact Plating: Tin; Lead Free: Lead Free; Halogen Free: Halogen Free; Power Supply Rejection Ratio (PSRR): 65dB; Operating Supply Voltage: 16V; Package Quantity: 2500; Max Operating Temperature: 70°C; Case/Package: SOIC; Height: 1.5mm; Packaging: Tape and Reel; Radiation Hardening: No; Number of Channels: 2; Bandwidth: 1MHz; Length: 5mm; Number of Elements: 2; Number of Amplifiers: 2; Output Current per Channel: 40mA
U3 = TL431_SOT-23-3
U5 = LM2576D2T-005G